# EAGLE schematic HEL-IOT-0.4 (EAGLE 7.5.0)
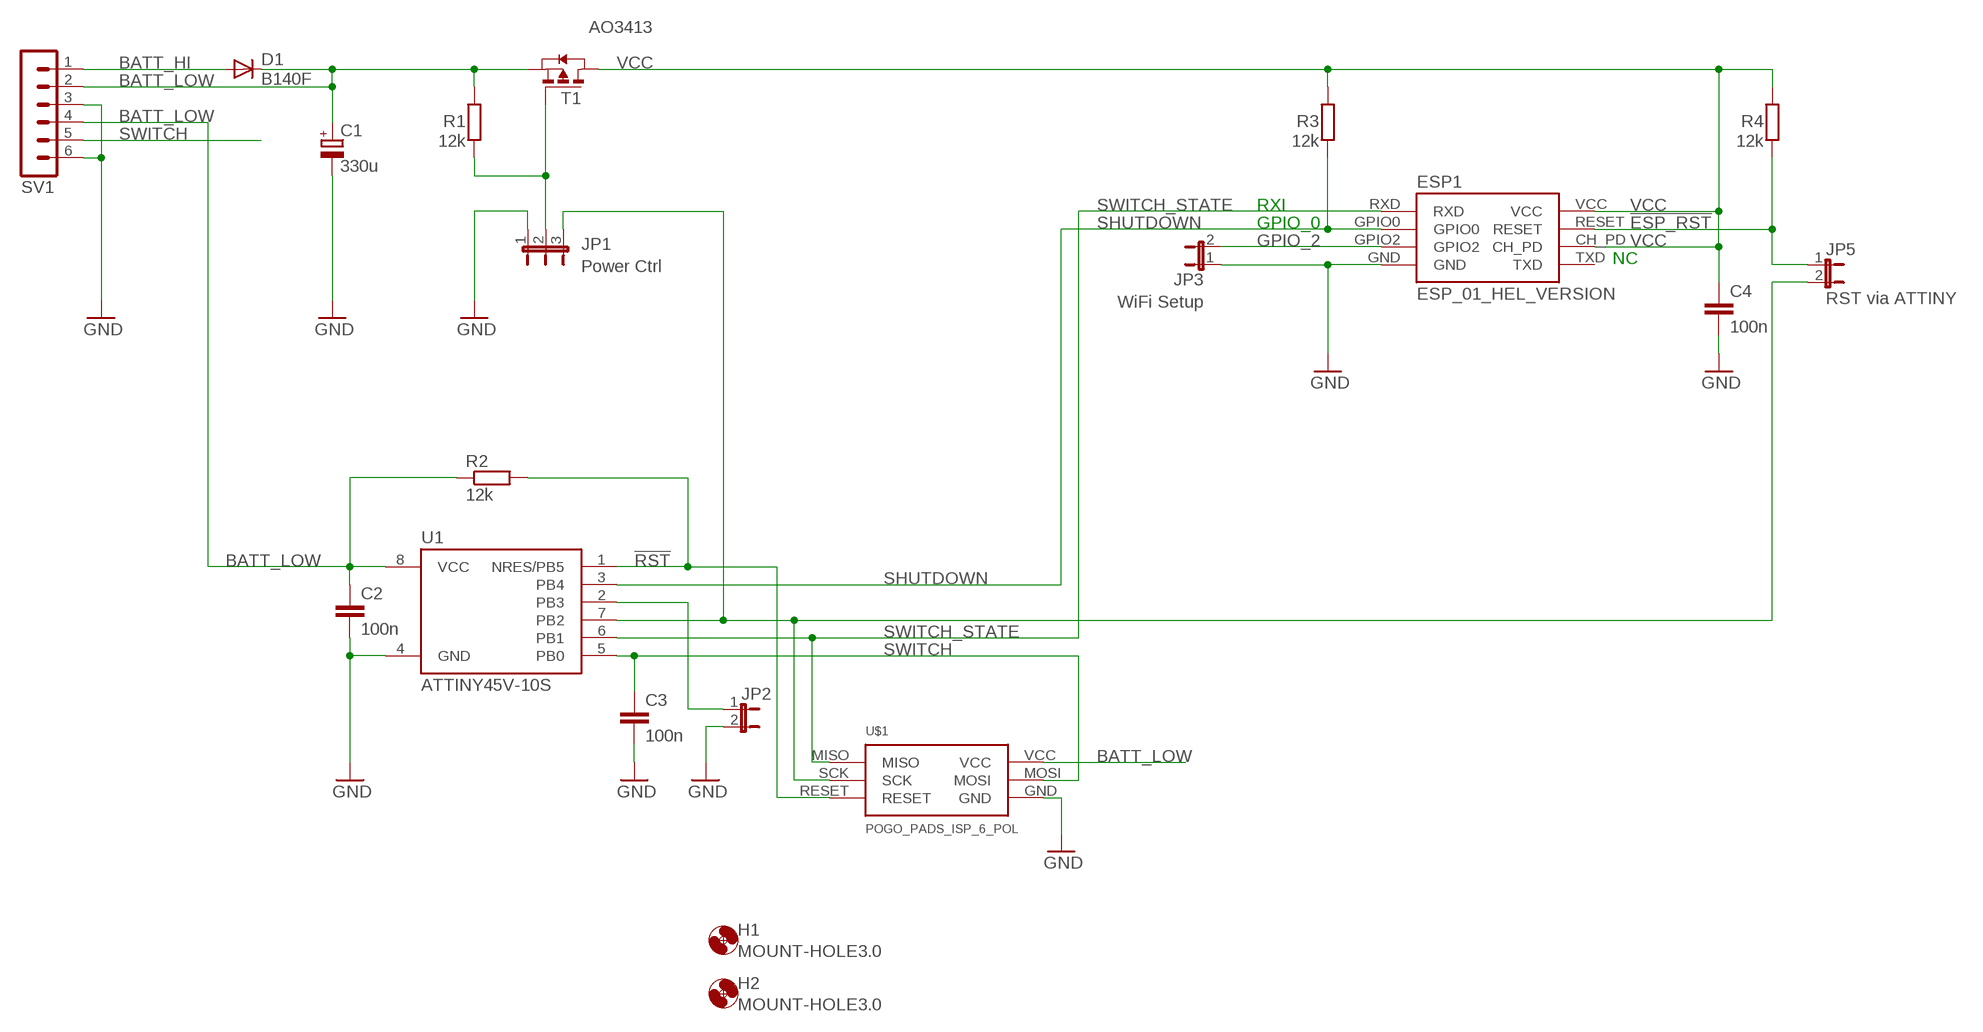
[diagram p0: schematic, sheet 1]

## Parts
C1  330u  CPOL-EUUD-8X10  [UD-8X10_NICHICON]
C2  100n  C-EUC3225  [C3225]
C3  100n  C-EUC3225  [C3225]
C4  100n  C-EUC3225  [C3225]
D1  B140F  DIODE-DO214AA  [DO214AA]
ESP1  ESP_01_HEL_VERSION  [CUSTOM_ESP01_FOR_HEL]
H1  MOUNT-HOLE3.0  [3,0]
H2  MOUNT-HOLE3.0  [3,0]
JP1  Power Ctrl  JP2E  [JP2]
JP2  JP1E  [JP1]
JP3  WiFi Setup  JP1E  [JP1]
JP5  RST via ATTINY  JP1E  [JP1]
R1  12k  R-EU_R0805  [R0805]
R2  12k  R-EU_R0805  [R0805]
R3  12k  R-EU_R0805  [R0805]
R4  12k  R-EU_R0805  [R0805]
SV1  MA06-1  [MA06-1]
T1  AO3413  PMOSSOT23  [SOT-23]
U1  ATTINY45V-10S  [SOIC8_EIAJ_208MIL]
U$1  POGO_PADS_ISP_6_POL  [POGO_PADS_ISP_6_POL]

## Nets
!ESP_RST: ESP1.RESET JP5.1 R4.1
!RST: R2.2 U1.1(NRES/PB5) U$1.RESET
BATT_HI: D1.A SV1.1
BATT_LOW: C1.+ C2.1 D1.C R1.2 R2.1 SV1.2 SV1.4 T1.2(S) U1.8(VCC) U$1.VCC
GND: C1.- C2.2 C3.2 C4.2 ESP1.GND JP1.1 JP2.2 JP3.1 SV1.3 SV1.6 U1.4(GND) U$1.GND
GPIO_2: ESP1.GPIO2 JP3.2
N$1: JP2.1 U1.2(PB3)
N$5: JP1.2 R1.1 T1.3(G)
N$8: JP1.3 JP5.2 U1.7(PB2) U$1.SCK
SHUTDOWN: ESP1.GPIO0 R3.1 U1.3(PB4)
SWITCH: C3.1 SV1.5 U1.5(PB0) U$1.MOSI
SWITCH_STATE: ESP1.RXD U1.6(PB1) U$1.MISO
VCC: C4.1 ESP1.CH_PD ESP1.VCC R3.2 R4.2 T1.1(D)
Unconnected: ESP1.TXD

## Notes on the sheet
- RXI
- GPIO_0
- NC

## Library data of the parts
C1 = rcl:CPOL-EU: POLARIZED CAPACITOR, European symbol
C2-C4 = resistor:C-EU: CAPACITOR, European symbol
D1 = diode:DIODE-: DIODE
ESP1 = ESP_HEL_VERSION:ESP_01_HEL_VERSION
H1 H2 = holes:MOUNT-HOLE: MOUNTING HOLE with drill center marker
JP1 = jumper:JP2E: JUMPER
JP2 JP3 JP5 = jumper:JP1E: JUMPER
R1-R4 = rcl:R-EU_: RESISTOR, European symbol
SV1 = con-lstb:MA06-1: PIN HEADER; OC_FARNELL: unknown; OC_NEWARK: unknown
T1 = zetex:PMOSSOT23: MOS FET; OC_FARNELL: unknown; OC_NEWARK: unknown
U1 = _hhn_attiny25_45_85:ATTINY45*: ATMEL ATtiny 45 Packages: P = PDIP 08 30mil S = SOIC 08 EIAJ 208mil X = TSSOP 08 4.4mm Technologies Note: for complete ordering code (temp. range, finish, tape&reel etc.) see www.atmel.com • Supply Voltage: V = (1.8…5.5)V | [blank] = (2.7…5.5)V • Speed: 10 = 10 MHz | 20 = 20 MHz Author: Dipl.-Ing. FH Rainer Bayer HHN Hochschule Heilbronn (Heilbronn University), rainer.bayer@hs-heilbronn.de Ingenieurbüro ing-rb, mail@ing-rb.de
U$1 = pogo_pads_ISP_6_pol:POGO_PADS_ISP_6_POL